# EasyEDA schematic Esquema_Nano-Osciloscopio-ATtiny85.json
TITLE: Nano Osciloscopio para ATtiny85; REV: NOS43; Date: 2026-09-25; Sheet: 1/1; Company: @alecelular
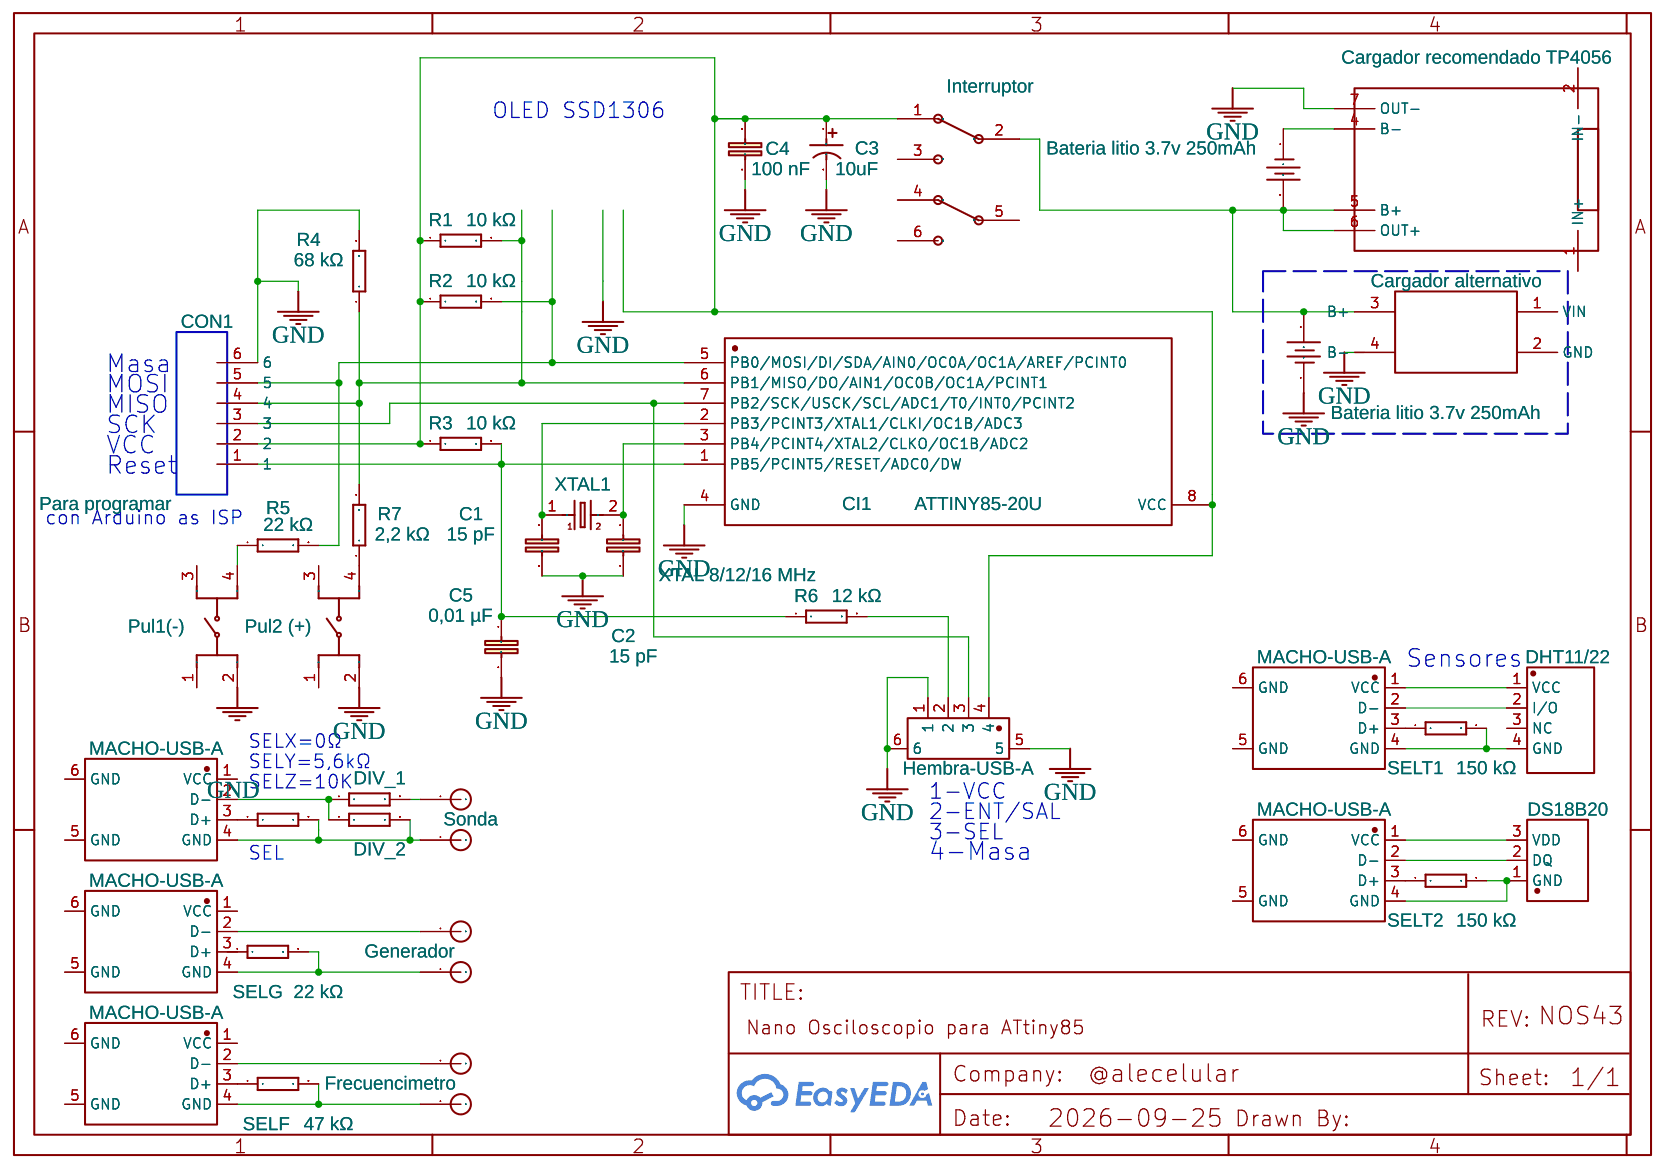
[diagram p0: schematic sheet]

## Parts
C1  15 pF  [C805]
C2  15 pF  [C805]
C3  10uF  [100UF CAPACITOR, 2.54MM PIN CAPACITOR]
C4  100 nF  [C805]
C5  0,01 µF  [C805]
CI1  ATTINY85-20U  [SOIC-8_L5.3-W5.3-P1.27-LS8.0-BL]
CON1  Para programar  [TERMINAL-BLOCK-6-PIN-3.5MM-LONG-PAD]
DIV_1  3,9 kΩ  [R1206]
DIV_2  3,9 kΩ  [R1206]
IC1  Cargador recomendado TP4056  [TP4056_1]
MACHO-USB-A  USB-ZD-136DIP  [USB-A-TH_USB-ZD-136DIP]
MACHO-USB-A#2  USB-ZD-136DIP  [USB-A-TH_USB-ZD-136DIP]
MACHO-USB-A#3  USB-ZD-136DIP  [USB-A-TH_USB-ZD-136DIP]
MACHO-USB-A#4  USB-ZD-136DIP  [USB-A-TH_USB-ZD-136DIP]
MACHO-USB-A#5  USB-ZD-136DIP  [USB-A-TH_USB-ZD-136DIP]
OPCIONAL  DHT11/22  [SENSOR-TH_DHT11-1]
R1  10 kΩ  [R1206]
R2  10 kΩ  [R1206]
R3  10 kΩ  [R1206]
R4  68 kΩ  [R1206]
R5  22 kΩ  [R1206]
R6  12 kΩ  [R1206]
R7  2,2 kΩ  [R1206]
SELF  47 kΩ  [R1206]
SELG  22 kΩ  [R1206]
SELT1  150 kΩ  [R1206]
SELT2  150 kΩ  [R1206]
SELY=3,9K  3,9 kΩ  [R1206]
U1  Cargador alternativo
U2  Pul1(-)  [PULSADOR]
U3  Hembra-USB-A  [USB-A-TH_USB-A-DIP_USB-234-BCW]
U4  DS18B20  [TO-92-3_L4.9-W3.7-P2.54-L]
U5  Pul2 (+)  [PULSADOR]
U6  Sonda
U7  Bateria litio 3.7v 250mAh  [BATTERY 3.7V 250MAH]
U8  Bateria litio 3.7v 250mAh  [BATTERY 3.7V 250MAH]
U9  Interruptor  [INTERRUPTOR]
U10  TP_N
U11  Generador
U12  TP_N
U13  TP_N
U14  Frecuencimetro
XTAL1  XTAL 8/12/16 MHz  [XTAL_5X8]

## Library data of the parts
C1 C2 C4 C5 = CAPACITOR_NPOL: Contributor: DangerousPrototype
C3 = CAPACITOR COPY: Manufacturer: CX(承兴); Manufacturer Part: KM476M016D11RR0VH2FP0; JLCPCB Part Class: Extended Part; Contributor: Hacket
CI1 = ATTINY85-20SU: Supplier: LCSC; Manufacturer: MICROCHIP(美国微芯); Supplier Part: C89852; JLCPCB Part Class: Extended Part
CON1 = nik TERMINAL-BLOCK-3.5MM-6-PIN-LONG-PAD: Contributor: nikunj151089
DIV_1 DIV_2 R1-R7 SELF SELG SELT1 SELT2 SELY=3,9K = RESISTOR: Contributor: DangerousPrototype
IC1 = TP4056_1: Contributor: emiliopisa
MACHO-USB-A MACHO-USB-A#2-MACHO-USB-A#5 = USB-ZD-136DIP: Supplier: LCSC; Supplier Part: C5273997; Manufacturer: HDGC(华德共创); Contributor: lcsc; JLCPCB Part Class: Extended Part
OPCIONAL = DHT11_C87032: Supplier Part: C87032; Supplier: LCSC; Manufacturer: AOSONG; Manufacturer Part: DHT11; JLCPCB Part Class: Extended Part
U1 = Caricatore pacco batterie litio: Contributor: pablito239910
U2 U5 = MINIPULSADOR: Supplier: Add New Supplier; Contributor: ANGEL3
U3 = USB-A-DIP_USB-234-BCW: Supplier: LCSC; Supplier Part: C9900005365; Manufacturer: null; Contributor: lcsc; JLCPCB Part Class: Extended Part
U4 = DS18B20+T&amp;R: Contributor: LCSC; Supplier: LCSC; Supplier Part: C880672; Manufacturer: ADI(亚德诺)/MAXIM(美信); Manufacturer Part: DS18B20+T&R; JLCPCB Part Class: Extended Part
U6 U11 U14 = TP_P: Contributor: aiglesias
U7 U8 = Battery 3.7v 250mAh 401730: Supplier: LCSC; Supplier Part: C42404726; Manufacturer: XINJ; Manufacturer Part: SVM1030 3.7V 110mA; Contributor: eo03um
U9 = Interruptor: Contributor: Msalatir
U10 U12 U13 = TP_N: Contributor: aiglesias
XTAL1 = OSC-XTAL-8M: Contributor: DangerousPrototype

## Nets
GND: C1.2 C2.2 C3.2 C4.2 C5.2 CI1.4(GND) IC1.7(OUT-) R4.2 U2.2 U3.1 U3.5 U3.6 U5.2 U8.1
Net-(C1-1): C1.1 CI1.2(PB3/PCINT3/XTAL1/CLKI/OC1B/ADC3) XTAL1.1
Net-(C2-1): C2.1 CI1.3(PB4/PCINT4/XTAL2/CLKO/OC1B/ADC2) XTAL1.2
Net-(C3-1): C3.1 C4.1 CI1.8(VCC) R1.1 R2.1 R3.1 U3.4 U9.1(NC)
Net-(C5-1): C5.1 CI1.1(PB5/PCINT5/RESET/ADC0/DW) R3.2 R6.1
Net-(CI1-5): CI1.5(PB0/MOSI/DI/SDA/AIN0/OC0A/OC1A/AREF/PCINT0) R2.2 R5.2
Net-(CI1-6): CI1.6(PB1/MISO/DO/AIN1/OC0B/OC1A/PCINT1) R1.2 R4.1 R7.2
Net-(CI1-7): CI1.7(PB2/SCK/USCK/SCL/ADC1/T0/INT0/PCINT2) U3.3
Net-(DIV_1-1): DIV_1.1 DIV_2.1 MACHO-USB-A#3.2(D-)
Net-(DIV_1-2): DIV_1.2 U6.1
Net-(DIV_2-2): DIV_2.2 MACHO-USB-A#3.4(GND) SELY=3,9K.2 U10.1
Net-(IC1-4): IC1.4(B-) U7.1
Net-(IC1-5): IC1.5(B+) IC1.6(OUT+) U7.2 U8.2 U9.2(C)
Net-(MACHO-USB-A#2-1): MACHO-USB-A#2.1(VCC) U4.3(VDD)
Net-(MACHO-USB-A#2-2): MACHO-USB-A#2.2(D-) U4.2(DQ)
Net-(MACHO-USB-A#2-3): MACHO-USB-A#2.3(D+) SELT2.1
Net-(MACHO-USB-A#2-4): MACHO-USB-A#2.4(GND) SELT2.2 U4.1(GND)
Net-(MACHO-USB-A#3-3): MACHO-USB-A#3.3(D+) SELY=3,9K.1
Net-(MACHO-USB-A#4-2): MACHO-USB-A#4.2(D-) U11.1
Net-(MACHO-USB-A#4-4): MACHO-USB-A#4.4(GND) SELG.2 U12.1
Net-(MACHO-USB-A#5-2): MACHO-USB-A#5.2(D-) U14.1
Net-(MACHO-USB-A#5-3): MACHO-USB-A#5.3(D+) SELF.1
Net-(MACHO-USB-A#5-4): MACHO-USB-A#5.4(GND) SELF.2 U13.1
Net-(MACHO-USB-A-1): MACHO-USB-A.1(VCC) OPCIONAL.1(VCC)
Net-(MACHO-USB-A-2): MACHO-USB-A.2(D-) OPCIONAL.2(I/O)
Net-(MACHO-USB-A-3): MACHO-USB-A.3(D+) SELT1.1
Net-(MACHO-USB-A-4): MACHO-USB-A.4(GND) OPCIONAL.4(GND) SELT1.2
Net-(R5-1): R5.1 U2.4
Net-(R6-2): R6.2 U3.2
Net-(R7-1): R7.1 U5.4

Not connected (* = marked no-connect by the designer): CON1 1 2 3 4 5 6; IC1 1(IN+) 2(IN-); MACHO-USB-A 5(GND) 6(GND); MACHO-USB-A#2 5(GND) 6(GND); MACHO-USB-A#3 1(VCC) 5(GND) 6(GND); MACHO-USB-A#4 1(VCC) 3(D+) 5(GND) 6(GND); MACHO-USB-A#5 1(VCC) 5(GND) 6(GND); OPCIONAL 3(NC); SELG 1; U1 1(VIN) 2(GND) 3(B+) 4(B-); U2 1 3; U5 1 3; U9 3(NO) 4(NC) 5(C) 6(NO)

## Notes on the sheet
- OLED SSD1306
- MOSI
- Masa
- MISO
- SCK
- VCC
- Reset
- con Arduino as ISP
- Sensores
- SELX=0Ω
- SELY=5,6kΩ
- SELZ=10K
- 1-VCC
- 2-ENT/SAL
- 3-SEL
- SEL
- 4-Masa
